# EAGLE design mini (EAGLE 7.1.0)
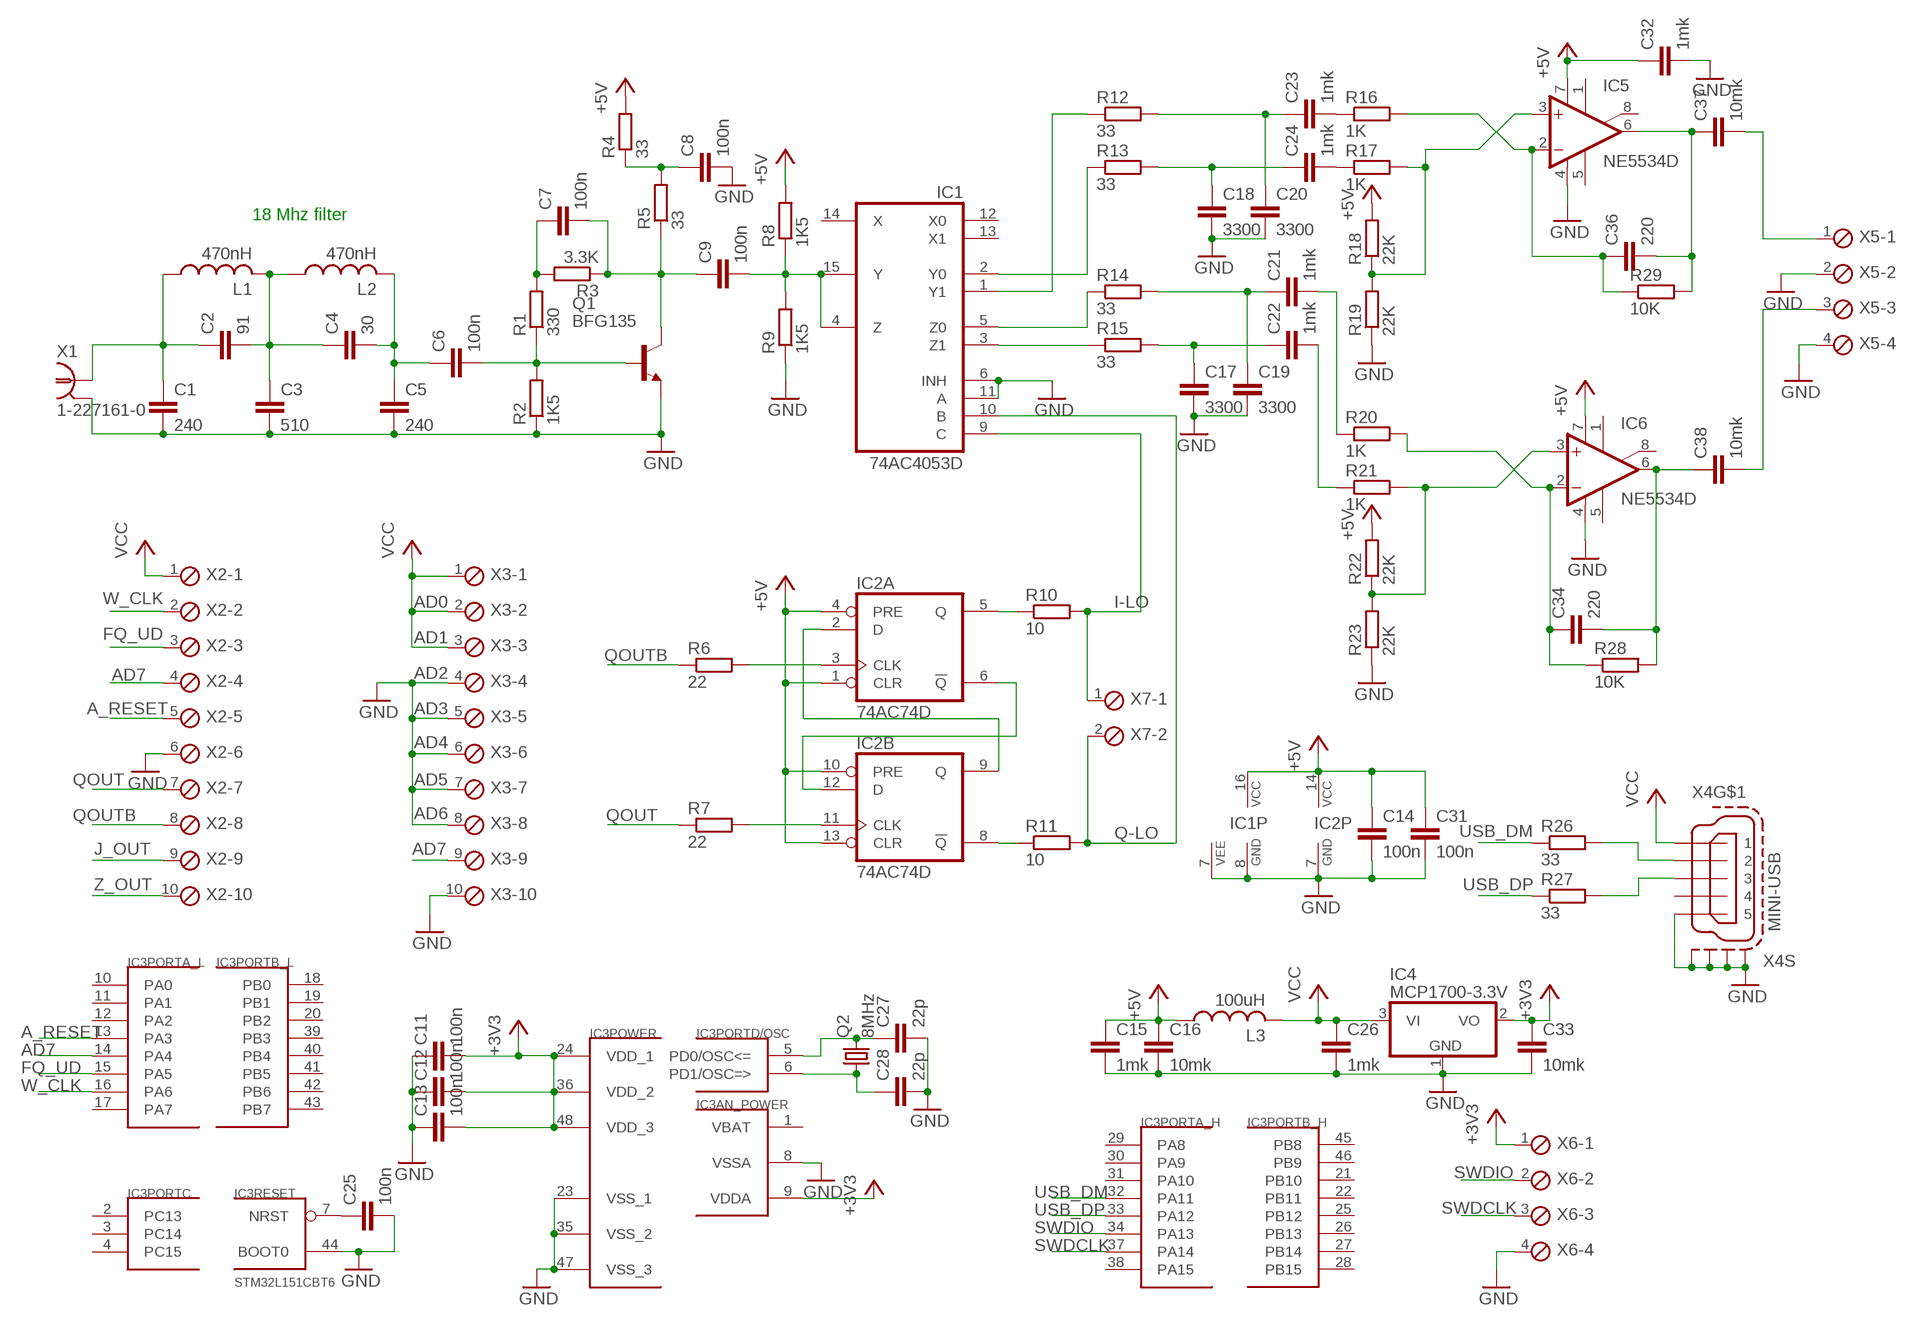
[diagram p0: schematic, sheet 1]

## Parts
C1  240  C-EUC0805  [C0805]
C2  91  C-EUC0805  [C0805]
C3  510  C-EUC0805  [C0805]
C4  30  C-EUC0805  [C0805]
C5  240  C-EUC0805  [C0805]
C6  100n  C-EUC0603  [C0603]
C7  100n  C-EUC0603  [C0603]
C8  100n  C-EUC0603  [C0603]
C9  100n  C-EUC0603  [C0603]
C11  100n  C-EUC0603  [C0603]
C12  100n  C-EUC0603  [C0603]
C13  100n  C-EUC0603  [C0603]
C14  100n  C-EUC0603  [C0603]
C15  1mk  C-EUC0603  [C0603]
C16  10mk  C-EUC0805  [C0805]
C17  3300  C-EUC0805  [C0805]
C18  3300  C-EUC0805  [C0805]
C19  3300  C-EUC0805  [C0805]
C20  3300  C-EUC0805  [C0805]
C21  1mk  C-EUC0603  [C0603]
C22  1mk  C-EUC0603  [C0603]
C23  1mk  C-EUC0603  [C0603]
C24  1mk  C-EUC0603  [C0603]
C25  100n  C-EUC0603  [C0603]
C26  1mk  C-EUC0603  [C0603]
C27  22p  C-EUC0603  [C0603]
C28  22p  C-EUC0603  [C0603]
C31  100n  C-EUC0603  [C0603]
C32  1mk  C-EUC0603  [C0603]
C33  10mk  C-EUC0805  [C0805]
C34  220  C-EUC0805  [C0805]
C36  220  C-EUC0805  [C0805]
C37  10mk  C-EUC0805  [C0805]
C38  10mk  C-EUC0805  [C0805]
IC1  74AC4053D  4053D  [SO16]
IC2  74AC74D  [SO14]
IC3  STM32L151CBT6  STM32F10XCXT6  [TQFP48]
IC4  MCP1700-3.3V  MCP1703CB  [SOT23]
IC5  NE5534D  [SO08]
IC6  NE5534D  [SO08]
L1  470nH  L-USL3225M  [L3225M]
L2  470nH  L-USL3225M  [L3225M]
L3  100uH  L-US0207/12  [0207/12]
Q1  BFG135  [SOT223]
Q2  8MHz  CRYSTALHC49S  [HC49/S]
R1  330  R-EU_R0603  [R0603]
R2  1K5  R-EU_R0603  [R0603]
R3  3.3K  R-EU_R0603  [R0603]
R4  33  R-EU_R0603  [R0603]
R5  33  R-EU_R0603  [R0603]
R6  22  R-EU_R0603  [R0603]
R7  22  R-EU_R0603  [R0603]
R8  1K5  R-EU_R0603  [R0603]
R9  1K5  R-EU_R0603  [R0603]
R10  10  R-EU_R0603  [R0603]
R11  10  R-EU_R0603  [R0603]
R12  33  R-EU_R0603  [R0603]
R13  33  R-EU_R0603  [R0603]
R14  33  R-EU_R0603  [R0603]
R15  33  R-EU_R0603  [R0603]
R16  1K  R-EU_R0603  [R0603]
R17  1K  R-EU_R0603  [R0603]
R18  22K  R-EU_R0603  [R0603]
R19  22K  R-EU_R0603  [R0603]
R20  1K  R-EU_R0603  [R0603]
R21  1K  R-EU_R0603  [R0603]
R22  22K  R-EU_R0603  [R0603]
R23  22K  R-EU_R0603  [R0603]
R26  33  R-EU_R0603  [R0603]
R27  33  R-EU_R0603  [R0603]
R28  10K  R-EU_R0603  [R0603]
R29  10K  R-EU_R0603  [R0603]
X1  1-227161-0  [AMP_227161]
X2  MPT10  [10POL254]
X3  MPT10  [10POL254]
X4  MINI-USB  MINI-USB-SCHIELD-32005-301  [32005-301]
X5  MPT4  [4POL254]
X6  MPT4  [4POL254]
X7  MPT2  [2POL254]

## Nets
+3V3: C11.2 C12.2 C13.2 C33.1 IC3.9(AN_POWER:VDDA) IC3.24(POWER:VDD_1) IC3.36(POWER:VDD_2) IC3.48(POWER:VDD_3) IC4.2(VO) X6.1
+5V: C14.1 C15.1 C16.1 C31.1 C32.1 IC1.16(VCC) IC2.1(A:CLR) IC2.4(A:PRE) IC2.10(B:PRE) IC2.13(B:CLR) IC2.14(P:VCC) IC5.7(V+) IC6.7(V+) L3.1 R4.2 R8.2 R18.2 R22.2
A_RESET: IC3.13(PORTA_L:PA3) X2.5
AD7: IC3.14(PORTA_L:PA4) X2.4
FQ_UD: IC3.15(PORTA_L:PA5) X2.3
GND: C1.2 C3.2 C5.2 C8.2 C11.1 C12.1 C13.1 C14.2 C15.2 C16.2 C17.2 C18.2 C19.2 C20.2 C25.2 C26.2 C27.2 C28.2 C31.2 C32.2 C33.2 IC1.6(INH) IC1.7(VEE) IC1.8(GND) IC1.11(A) IC2.7(P:GND) IC3.8(AN_POWER:VSSA) IC3.23(POWER:VSS_1) IC3.35(POWER:VSS_2) IC3.44(RESET:BOOT0) IC3.47(POWER:VSS_3) IC4.1(GND) IC5.4(V-) IC6.4(V-) Q1.1(E) Q1.3(E) R2.1 R9.1 R19.1 R23.1 X1.2 X2.6 X3.4 X3.5 X3.6 X3.7 X3.8 X3.10 X4.5 X4.M1(S:S1) X4.M2(S:S2) X4.M3(S:S3) X4.M4(S:S4) X5.2 X5.4 X6.4
I-LO: IC1.9(C) R10.2 X7.1
J_OUT: X2.9
N$1: IC2.2(A:D) IC2.9(B:Q)
N$2: IC2.6(A:!Q) IC2.12(B:D)
N$3: IC2.5(A:Q) R10.1
N$4: IC2.8(B:!Q) R11.1
N$5: IC1.3(Z1) R15.1
N$6: C9.2 IC1.4(Z) IC1.15(Y) R8.1 R9.2
N$7: C7.1 R1.2 R3.2
N$8: IC1.5(Z0) R14.1
N$9: IC1.2(Y0) R13.1
N$10: IC1.1(Y1) R12.1
N$11: C17.1 C22.1 R15.2
N$12: C19.1 C21.1 R14.2
N$13: C18.1 C24.1 R13.2
N$14: C20.1 C23.1 R12.2
N$15: IC5.3(+IN) R17.2 R18.1 R19.2
N$16: C34.2 C38.1 IC6.6(OUT) R28.2
N$17: C36.1 IC5.2(-IN) R16.2 R29.1
N$18: C36.2 C37.1 IC5.6(OUT) R29.2
N$19: C23.2 R16.1
N$20: C21.2 R20.1
N$21: C22.2 R21.1
N$22: C34.1 IC6.2(-IN) R20.2 R28.1
N$23: IC6.3(+IN) R21.2 R22.1 R23.2
N$25: C24.2 R17.1
N$27: C27.1 IC3.5(PORTD/OSC:PD0/OSC<=) Q2.2
N$28: R26.2 X4.2
N$29: R27.2 X4.3
N$30: C28.1 IC3.6(PORTD/OSC:PD1/OSC=>) Q2.1
N$31: IC2.3(A:CLK) R6.2
N$32: IC2.11(B:CLK) R7.2
N$33: C4.2 C5.1 C6.1 L2.2
N$34: C7.2 C9.1 Q1.4(C) R3.1 R5.1
N$35: C25.1 IC3.7(RESET:NRST)
N$36: X3.9
N$37: C8.1 R4.1 R5.2
N$38: C37.2 X5.1
N$39: C38.2 X5.3
N$40: C1.1 C2.1 L1.1 X1.1
N$41: C2.2 C3.1 C4.1 L1.2 L2.1
N$44: C6.2 Q1.2(B) R1.1 R2.2
Q-LO: IC1.10(B) R11.2 X7.2
QOUT: R7.1 X2.7
QOUTB: R6.1 X2.8
SWDCLK: IC3.37(PORTA_H:PA14) X6.3
SWDIO: IC3.34(PORTA_H:PA13) X6.2
USB_DM: IC3.32(PORTA_H:PA11) R26.1
USB_DP: IC3.33(PORTA_H:PA12) R27.1
VCC: C26.1 IC4.3(VI) L3.2 X2.1 X3.1 X3.2 X3.3 X4.1
W_CLK: IC3.16(PORTA_L:PA6) X2.2
Z_OUT: X2.10
Unconnected: IC1.12(X0) IC1.13(X1) IC1.14(X) IC3.2(PORTC:PC13) IC3.3(PORTC:PC14) IC3.4(PORTC:PC15) IC3.10(PORTA_L:PA0) IC3.11(PORTA_L:PA1) IC3.12(PORTA_L:PA2) IC3.17(PORTA_L:PA7) IC3.18(PORTB_L:PB0) IC3.19(PORTB_L:PB1) IC3.20(PORTB_L:PB2) IC3.21(PORTB_H:PB10) IC3.22(PORTB_H:PB11) IC3.25(PORTB_H:PB12) IC3.26(PORTB_H:PB13) IC3.27(PORTB_H:PB14) IC3.28(PORTB_H:PB15) IC3.29(PORTA_H:PA8) IC3.30(PORTA_H:PA9) IC3.31(PORTA_H:PA10) IC3.38(PORTA_H:PA15) IC3.39(PORTB_L:PB3) IC3.40(PORTB_L:PB4) IC3.41(PORTB_L:PB5) IC3.42(PORTB_L:PB6) IC3.43(PORTB_L:PB7) IC3.45(PORTB_H:PB8) IC3.46(PORTB_H:PB9) IC5.1(ON) IC5.5(CMP) IC5.8(ON/CMP) IC6.1(ON) IC6.5(CMP) IC6.8(ON/CMP) X4.4

## Notes on the sheet
- 18 Mhz filter
- AD0
- AD1
- AD2
- AD3
- AD4
- AD5
- AD6
- AD7

## Power pins joined to a net without a drawn wire
VBAT: IC3.1(AN_POWER:VBAT)

## Library data of the parts
C1-C9 C11-C28 C31-C34 C36-C38 = rcl:C-EU: CAPACITOR, European symbol
IC1 = 40xx:4053: Triple 2-channel ANALOG MULTIPLEXER
IC2 = 74xx-eu:74*74: Dual D type positive edge triggered FLIP FLOP, preset and clear
IC3 = stm32:STM32F10XCXT6: ST STM32F101/103 48pin LQFP
IC4 = linear:MCP1703: 250 mA, 16V, Low Quiescent Current LDO Regulator Source: http://ww1.microchip.com/downloads/en/DeviceDoc/22049b.pdf
IC5 IC6 = linear:NE5534: LOW-NOISE OPERATIONAL AMPLIFIER Source: http://focus.ti.com/lit/ds/symlink/ne5534.pdf
L1-L3 = rcl:L-US: INDUCTOR, American symbol
Q1 = balmer:BFG135: 7 GHz tranzistor
Q2 = crystal:CRYSTAL: CRYSTAL; OC_FARNELL: 1667008; OC_NEWARK: unknown
R1-R23 R26-R29 = rcl:R-EU_: RESISTOR, European symbol
X1 = con-coax:?227161*: JACK, RIGHT ANGLE, 50 OHM, PCB, BNC Source: amp_227161.pdf; MF: TYCO ELECTRONICS; MPN: 1-227161; OC_FARNELL: unknown; OC_NEWARK: 33B3200
X2 X3 = con-phoenix-254:MPT10: PHOENIX CONNECTOR; OC_FARNELL: unknown; OC_NEWARK: unknown
X4 = con-cypressindustries:MINI-USB-SCHIELD-: MINI USB-B Conector Source: www.cypressindustries.com; OC_FARNELL: unknown; OC_NEWARK: unknown
X5 X6 = con-phoenix-254:MPT4: PHOENIX CONNECTOR; OC_FARNELL: unknown; OC_NEWARK: unknown
X7 = con-phoenix-254:MPT2: PHOENIX CONNECTOR; OC_FARNELL: unknown; OC_NEWARK: unknown

## Board
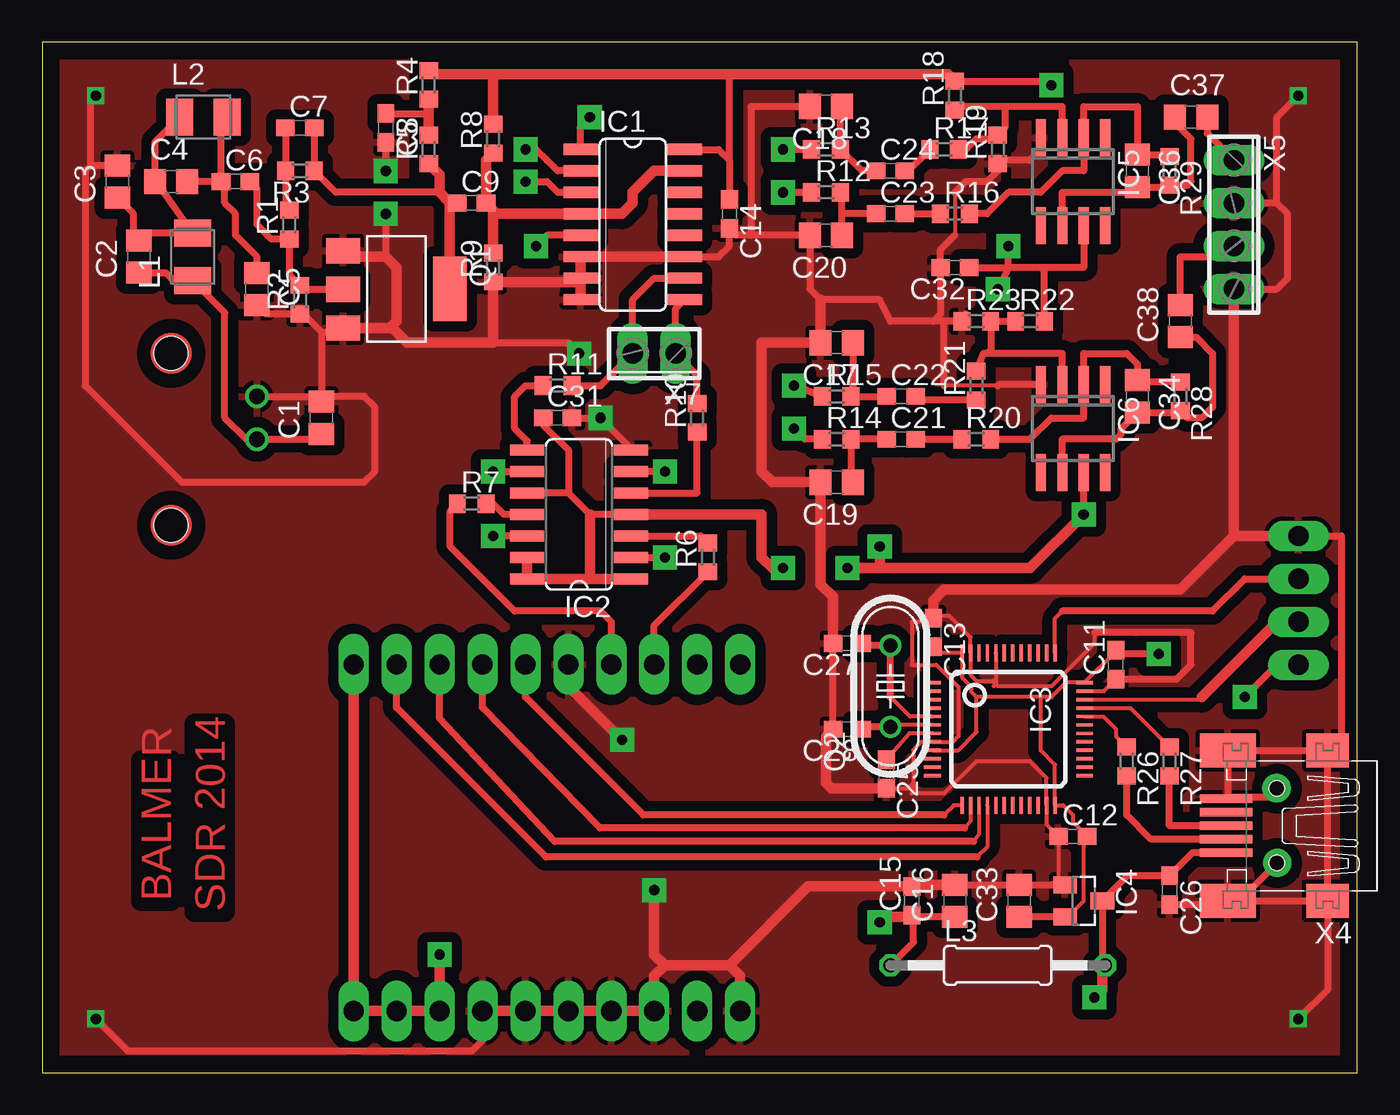
[diagram p1: board, top side]
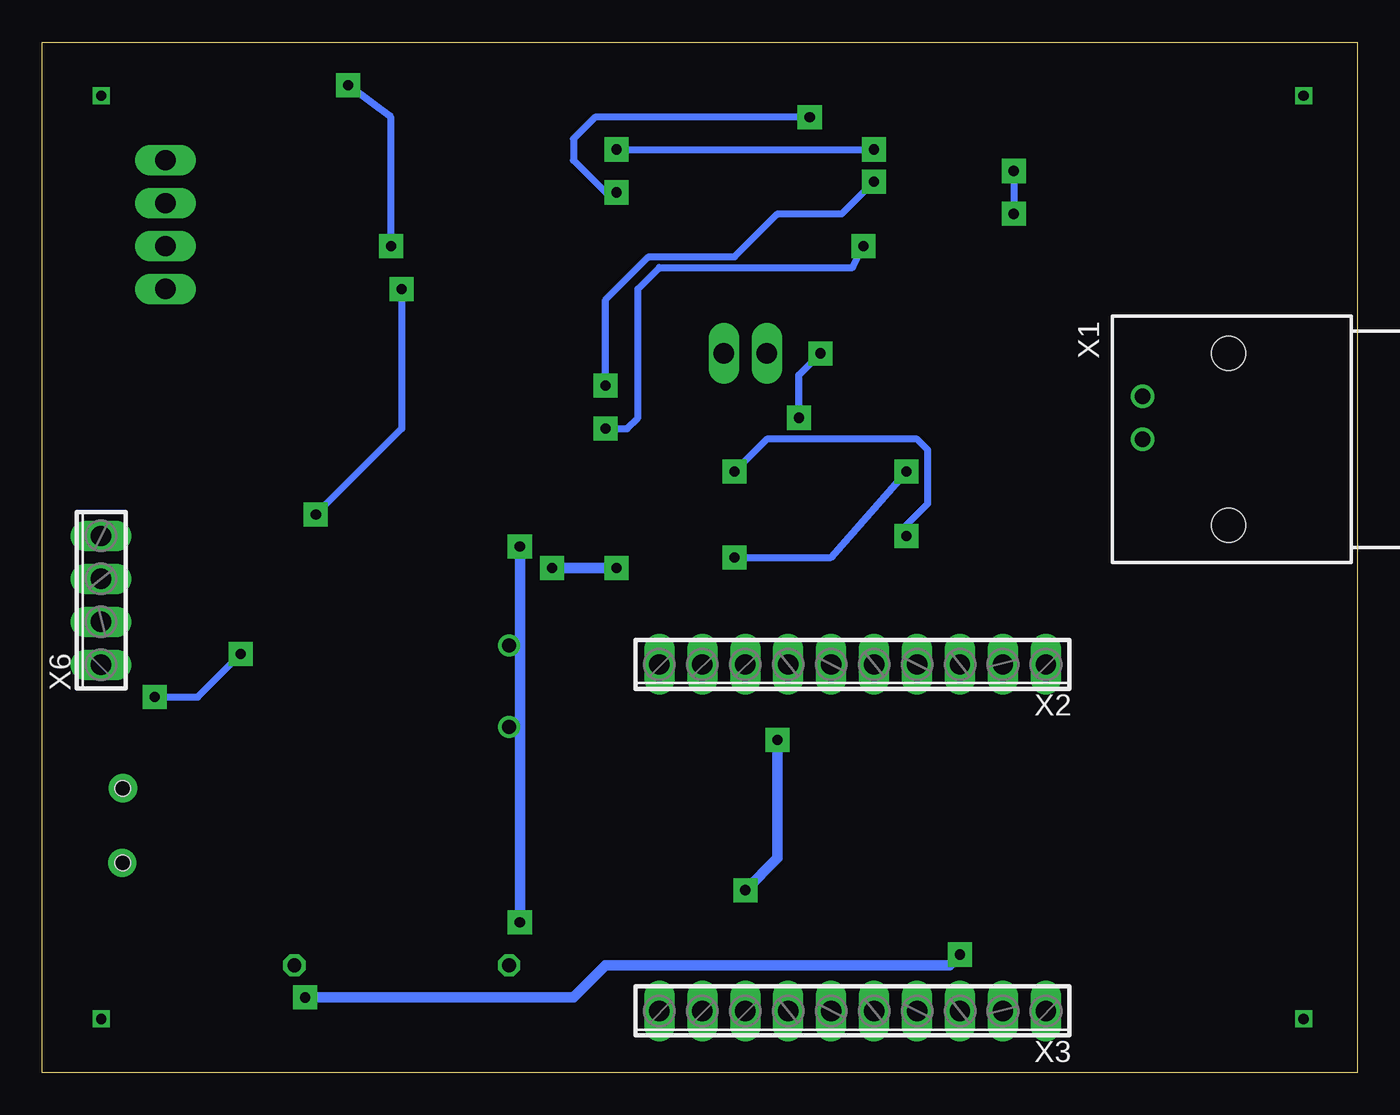
[diagram p2: board, bottom side, seen from below]

Size 77.78 x 60.95 mm. Coordinates in mm from the lower left corner, seen from the top.
Outline: 0,0 77.78,0 77.78,60.95 0,60.95 0,0
Copper layers (1*16): Top 0.035mm / dielectric 1.5mm / Bottom 0.035mm
Design rules "default": minimum track width 10mil, minimum drill 24mil, track to track 8mil, track to pad 8mil, pad to pad 8mil, via to via 8mil, smd to smd 8mil, copper to edge 40mil, drill to drill 8mil, minimum pad ring 10mil, minimum via ring 8mil, stop-mask expansion 4mil, vias tented up to drill 0mil, thermal gap 10mil

### Footprints (pad centres in the part's own frame; a part is rotated, then mirrored left to right if it is on the bottom)
C0805 = smd 1.3 x 1.5: 1 -0.95,0; 2 0.95,0
C0603 = smd 1.1 x 1: 1 -0.85,0; 2 0.85,0
SO16 = smd 0.66 x 2.032: 1 -4.445,-3.073; 2 -3.175,-3.073; 3 -1.905,-3.073; 4 -0.635,-3.073; 5 0.635,-3.073; 6 1.905,-3.073; 7 3.175,-3.073; 8 4.445,-3.073; 9 4.445,3.073; 10 3.175,3.073; 11 1.905,3.073; 12 0.635,3.073; 13 -0.635,3.073; 14 -1.905,3.073; 15 -3.175,3.073; 16 -4.445,3.073
SO14 = smd 0.66 x 2.032: 1 -3.81,-3.073; 2 -2.54,-3.073; 3 -1.27,-3.073; 4 0,-3.073; 5 1.27,-3.073; 6 2.54,-3.073; 7 3.81,-3.073; 8 3.81,3.073; 9 2.54,3.073; 10 1.27,3.073; 11 0,3.073; 12 -1.27,3.073; 13 -2.54,3.073; 14 -3.81,3.073
TQFP48 = smd 0.2 x 1: 1 -2.75,-4.5; 2 -2.25,-4.5; 3 -1.75,-4.5; 4 -1.25,-4.5; 5 -0.75,-4.5; 6 -0.25,-4.5; 7 0.25,-4.5; 8 0.75,-4.5; 9 1.25,-4.5; 10 1.75,-4.5; 11 2.25,-4.5; 12 2.75,-4.5; 25 2.75,4.5; 26 2.25,4.5; 27 1.75,4.5; 28 1.25,4.5; 29 0.75,4.5; 30 0.25,4.5; 31 -0.25,4.5; 32 -0.75,4.5; 33 -1.25,4.5; 34 -1.75,4.5; 35 -2.25,4.5; 36 -2.75,4.5 | smd 1 x 0.2: 13 4.5,-2.75; 14 4.5,-2.25; 15 4.5,-1.75; 16 4.5,-1.25; 17 4.5,-0.75; 18 4.5,-0.25; 19 4.5,0.25; 20 4.5,0.75; 21 4.5,1.25; 22 4.5,1.75; 23 4.5,2.25; 24 4.5,2.75; 37 -4.5,2.75; 38 -4.5,2.25; 39 -4.5,1.75; 40 -4.5,1.25; 41 -4.5,0.75; 42 -4.5,0.25; 43 -4.5,-0.25; 44 -4.5,-0.75; 45 -4.5,-1.25; 46 -4.5,-1.75; 47 -4.5,-2.25; 48 -4.5,-2.75
SOT23 = smd 1 x 1.4: 1 -0.95,-1.1; 2 0.95,-1.1; 3 0,1.1
SO08 = smd 0.6 x 2.2: 1 -1.905,-2.6; 2 -0.635,-2.6; 3 0.635,-2.6; 4 1.905,-2.6; 5 1.905,2.6; 6 0.635,2.6; 7 -0.635,2.6; 8 -1.905,2.6
L3225M = smd 1.6 x 2.2: 1 -1.4,0; 2 1.4,0
0207/12 = drill 0.813 octagon: 1 -6.35,0; 2 6.35,0
SOT223 = smd 1.499 x 2.007: 1 -2.261,-3.15; 2 0.025,-3.15; 3 2.311,-3.15 | smd 3.81 x 2.007: 4 0,3.15
HC49/S = drill 0.813: 1 -2.413,0; 2 2.413,0
R0603 = smd 1 x 1.1: 1 -0.85,0; 2 0.85,0
AMP_227161 = drill 0.9 pad 1.27: 1 0,-5.08; 2 -2.54,-5.08 | hole 2: -5.08,0; 5.08,0
10POL254 = drill 1.2 long: 1 -11.43,0; 2 -8.89,0; 3 -6.35,0; 4 -3.81,0; 5 -1.27,0; 6 1.27,0; 7 3.81,0; 8 6.35,0; 9 8.89,0; 10 11.43,0
32005-301 = smd 3.1 x 0.5: 1 3,1.6; 2 3,0.8; 3 3,0; 4 3,-0.8; 5 3,-1.6 | smd 2.5 x 2: M1 -3,-4.45; M2 -3,4.45 | smd 3.3 x 2: M3 2.9,4.45; M4 2.9,-4.45 | hole 0.9: 0,2.2; 0,-2.2
4POL254 = drill 1.2 long: 1 -3.81,0; 2 -1.27,0; 3 1.27,0; 4 3.81,0
2POL254 = drill 1.2 long: 1 -1.27,0; 2 1.27,0

### Placement (x,y rotation side)
C1  16.51,38.73 90 top
C2  5.71,48.26 90 top
C3  4.45,52.7 90 top
C4  7.62,52.7 0 top
C5  12.7,46.35 270 top
C6  11.43,52.7 0 top
C7  15.24,55.88 0 top
C8  20.32,55.88 270 top
C9  25.4,51.44 0 top
C11  63.5,24.13 90 top
C12  60.96,13.97 0 top
C13  52.7,26.04 270 top
C14  40.64,50.8 270 top
C15  51.44,10.16 90 top
C16  53.98,10.16 90 top
C17  46.99,43.18 180 top
C18  46.35,57.15 180 top
C19  46.99,34.92 180 top
C20  46.35,49.53 180 top
C21  50.8,37.47 0 top
C22  50.8,40.01 0 top
C23  50.16,50.8 0 top
C24  50.16,53.34 0 top
C25  49.92,17.67 270 top
C26  66.67,10.79 270 top
C27  47.62,25.4 180 top
C28  47.62,20.32 180 top
C31  30.48,38.73 0 top
C32  53.98,47.62 180 top
C33  57.78,10.16 90 top
C34  64.77,40.01 270 top
C36  64.77,53.34 270 top
C37  67.94,56.52 0 top
C38  67.31,44.45 90 top
IC1  34.92,50.16 270 top
IC2  31.75,33.02 90 top
IC3  57.15,20.32 270 top
IC4  61.59,10.16 270 top
IC5  60.96,52.7 180 top
IC6  60.96,38.1 180 top
L1  8.89,48.26 90 top
L2  9.53,56.52 0 top
L3  56.52,6.35 0 top
Q1  20.95,46.35 270 top
Q2  50.16,22.86 90 top
R1  14.61,50.16 90 top
R2  15.24,45.72 90 top
R3  15.24,53.34 180 top
R4  22.86,58.42 90 top
R5  22.86,54.61 90 top
R6  39.37,30.48 90 top
R7  25.4,33.66 0 top
R8  26.67,55.24 90 top
R9  26.67,47.62 90 top
R10  38.73,38.73 90 top
R11  30.48,40.64 0 top
R12  46.35,52.07 0 top
R13  46.35,54.61 0 top
R14  46.99,37.47 0 top
R15  46.99,40.01 0 top
R16  53.98,50.8 0 top
R17  53.34,54.61 0 top
R18  53.98,57.78 90 top
R19  56.52,54.61 90 top
R20  55.24,37.47 0 top
R21  55.24,40.64 90 top
R22  58.42,44.45 0 top
R23  55.24,44.45 0 top
R26  64.14,18.41 270 top
R27  66.67,18.41 270 top
R28  67.31,40.01 270 top
R29  66.67,53.34 270 top
X1  7.62,37.47 270 bottom
X2  29.84,24.15 180 bottom
X3  29.84,3.65 180 bottom
X4  73.03,14.61 180 top
X5  70.48,50.16 270 top
X6  74.3,27.94 90 bottom
X7  36.2,42.55 180 top

### Tracks (layer width: path | path; a pad name or v marks a point on that pad's centre or on a via)
+3V3  (via drill 0.6 pad 1.42)
  Top 0.25: C11.2 63.5,24.92 IC3.36 60.53,23.07 59.69,22.23 59.05,22.23 | C13.2 53.07,24.82 IC3.48 54.4,23.39 54.93,22.86 54.93,22.54 55.24,22.23 | 59.05,22.23 55.24,22.23 | IC3.9 54.17,19.07 55.26,20.16 55.26,22.21 55.24,22.23 | 59.05,22.23 59.05,19.05 59.9,18.2 IC3.24 60.38,15.82 60.96,15.24 60.96,14.82 C12.2 61.59,13.76 61.59,10.16 60.65,9.21 IC4.2
  Top 0.406: IC4.2 C33.1 57.69,9.31 | X6.1 73.03,24.13 v71.12,22.23 | v66.04,24.77 63.72,24.77 C11.2
  Bottom 0.406: v71.12,22.23 68.58,22.23 v66.04,24.77
+5V  (via drill 0.6 pad 1.42)
  Top 0.406: C16.1 51.53,9.21 | L3.1 51.53,7.72 51.53,9.21 | C31.1 29.63,38.31 31.11,36.83 31.11,34.29 | 31.11,34.29 IC2.10 | 31.11,34.29 32.38,33.02 IC2.4 | IC5.7 61.59,47.62 59.05,47.62 | 59.05,47.62 57.15,47.62 | v61.59,33.02 IC6.7 | R22.2 59.27,47.41 59.05,47.62 | IC1.16 40.01,54.61 40.64,53.98 | 40.64,53.98 C14.1 | 51.53,9.21 C15.1 | 57.15,47.62 v57.15,48.9 | 57.15,47.62 v56.52,46.35 | C32.1 57.15,47.62 | R18.2 59.48,58.63 v59.69,58.42 | 40.64,53.98 40.64,59.05
  Top 0.61: R8.2 26.67,59.05 | 26.67,59.05 23.07,59.05 R4.2 | IC2.1 32.38,29.21 | 32.38,29.21 32.38,33.02 | 32.38,29.21 IC2.14 IC2.13 | IC2.4 42.55,33.02 42.55,30.48 43.18,29.84 v43.81,29.84 | 49.53,29.84 58.42,29.84 v61.59,33.02 | 51.53,9.21 49.85,9.21 v49.53,8.89 | v49.53,31.11 49.53,29.84 | 49.53,29.84 v47.62,29.84 | 26.67,59.05 40.64,59.05 53.55,59.05 R18.2
  Bottom 0.406: v56.52,46.35 56.52,38.1 v61.59,33.02 | v57.15,48.9 57.15,56.52 v59.69,58.42
  Bottom 0.61: v49.53,8.89 v49.53,31.11 | v47.62,29.84 v43.81,29.84
A_RESET
  Top 0.25: IC3.13 53.92,15.82 53.34,15.24
  Top 0.406: 53.34,15.24 35.56,15.24 28.57,22.23 X2.5
AD7
  Top 0.25: IC3.14 54.9,14.89 54.57,14.48
  Top 0.406: 54.57,14.48 32.98,14.48 26.04,21.59 X2.4
FQ_UD
  Top 0.25: IC3.15 55.4,14.12 55.07,13.67
  Top 0.406: 55.07,13.67 30.31,13.67 23.5,20.95 X2.3
GND  (via drill 0.6, 0.6 pad 1.42, 0.6 pad 1.68)
  Top 0.25: IC3.35 62.79,22.57 C11.1 | 62.23,26.04 62.23,25.4 59.69,22.86 56.52,22.86 56.4,22.98 | IC3.44 56.4,22.98 | 56.28,22.86 56.4,22.98 | 56.4,22.98 56.2,23.18 55.24,23.18 54.9,23.52 IC3.47 54.9,25.76 53.65,27.01 52.83,27.01 C13.1 52.92,26.67 51.44,26.67 51.44,24.13 52.88,24.13 54.2,22.81 54.2,19.91 53.86,19.57 IC3.8 52.01,19.57 51.52,19.09 51.52,17.14 | 51.52,17.14 51.52,16.6 51.44,16.51 53.34,16.51 55.24,18.41 58.42,18.41 59.4,17.43 IC3.23 59.4,14.68 C12.1 60.11,11.53 59.69,11.11 | C25.2 51.2,16.82 51.52,17.14 | 56.52,40.64 53.34,40.64 | 53.98,52.07 53.98,49.53
  Top 0.406: 70.12,16.3 X4.M4 X4.M1 | 70.12,16.3 X4.5 | X4.M2 X4.M1 | X4.M3 X4.M2 | C26.2 69.92,9.95 X4.M3 | C33.2 59.69,11.11 IC4.1 | 57.69,11.01 C33.2 | C16.2 C33.2 | X4.M3 70.48,9.79 70.48,9.85 v73.05,12.41 | C11.1 67.09,23.28 67.94,24.13 67.94,26.04 62.23,26.04 | X6.4 76.83,31.75 76.83,19.86 X4.M1 | IC2.7 34.82,36.93 v33.02,38.73 C31.2 | 54.61,44.87 R23.1 53.34,44.45 | 53.34,44.45 52.7,44.45 | 52.7,44.45 50.16,44.45 49.53,45.72 46.04,45.72 45.41,46.35 C20.2 41.91,49.53 | C8.2 v20.32,53.34 | v20.32,50.8 20.32,48.26 | IC1.11 40.01,48.26 40.64,48.9 C14.2 41.06,49.53 41.91,49.53 | C28.2 C27.2 | 26.67,43.18 31.11,43.18 v31.75,42.55 | C18.2 41.91,57.15 41.91,49.53 | IC6.4 56.58,40.7 56.52,40.64 | 53.34,40.64 53.34,44.45 | X5.4 73.03,46.35 73.66,46.99 73.66,50.8 73.03,51.44 | 73.03,51.44 X5.2 | 52.7,44.45 53.12,44.87 C32.2 53.12,48.68 53.98,49.53 | 53.98,52.07 54.61,52.7 55.88,52.7 56.52,53.34 R19.1 56.73,53.98 58.42,53.98 59.05,54.61 IC5.4 | 16.51,43.81 15.46,44.87 R2.1 13.23,44.87 C5.2 | 16.51,43.81 17.58,43.81 Q1.3 | X1.2 16.19,40.01 C1.2 | 16.51,43.81 C1.2 | C3.2 2.85,53.66 | 2.85,53.66 2.54,53.34 2.54,40.64 8.26,34.92 19.05,34.92 19.68,35.56 19.68,39.37 19.05,40.01 16.83,40.01 C1.2 | 73.03,51.44 73.03,56.52 v74.3,57.78 | 70.12,16.3 72.5,16.3 v73.01,16.82 | X4.M2 76.03,4.91 v74.3,3.17 | 2.85,53.66 2.85,57.47 v3.17,57.78 | X3.4 26.04,1.91 25.4,1.27 5.08,1.27 v3.17,3.17
  Top 0.61: Q1.3 20.55,44.04 20.64,44.13 | 20.64,44.13 20.95,44.45 20.95,47.62 20.32,48.26 18.16,48.26 Q1.1 | 20.64,44.13 21.59,43.18 26.67,43.18 R9.1 31.64,46.77 IC1.7 | IC1.7 IC1.6 IC1.11 | IC1.8 IC1.7 | X3.4 X3.5 X3.6 X3.7 X3.8 36.2,5.71 36.83,6.35 | 36.83,6.35 40.64,6.35 | 40.64,6.35 41.27,5.71 X3.10 | C16.2 51.53,11.11 C15.2 45.3,11.01 40.64,6.35 | C25.2 46.68,16.82 46.35,17.14 46.35,19.9 C28.2 | C27.2 46.77,28.16 46.04,28.89 C19.2 43.18,34.92 42.55,35.56 42.55,43.18 C17.2 46.04,45.72 | 70.48,31.75 67.31,28.57 53.34,28.57 52.7,27.94 C13.1 | 70.48,31.75 X6.4 | X2.6 31.11,22.86 v34.29,19.68 | v36.2,10.79 36.2,6.99 36.83,6.35 | X5.4 70.48,31.75
  Bottom 0.406: v20.32,53.34 v20.32,50.8 | v33.02,38.73 33.02,41.27 v31.75,42.55
  Bottom 0.61: v34.29,19.68 34.29,12.7 v36.2,10.79
  pour Top (isolate 0.61): 0,60.96 78.11,60.96 78.11,0 0,0
I-LO
  Top 0.406: R10.2 38.73,41.27 X7.1 37.47,45.19 IC1.9
N$1  (via drill 0.6 pad 1.42)
  Top 0.406: IC2.2 v36.83,30.48 | v26.67,35.56 IC2.9
  Bottom 0.406: v36.83,30.48 31.11,30.48 v26.67,35.56
N$2  (via drill 0.6 pad 1.42)
  Top 0.406: IC2.12 v26.67,31.75 | v36.83,35.56 IC2.6
  Bottom 0.406: v26.67,31.75 26.67,32.38 25.4,33.66 25.4,36.83 26.04,37.47 34.92,37.47 v36.83,35.56
N$3
  Top 0.406: IC2.5 38.73,34.29 R10.1
N$4
  Top 0.406: IC2.8 28.68,37.36 27.94,38.1 27.94,40.01 28.57,40.64 R11.1
N$5  (via drill 0.6 pad 1.42)
  Top 0.406: R15.1 v44.45,40.64 | v28.57,52.7 29.84,52.7 30.48,52.07 IC1.3
  Bottom 0.406: v44.45,40.64 44.45,45.72 41.91,48.26 36.83,48.26 34.29,50.8 30.48,50.8 v28.57,52.7
N$6
  Top 0.61: 26.67,50.8 IC1.4 34.29,50.8 34.92,51.44 34.92,52.07 36.2,53.34 IC1.15 | R8.1 26.25,53.98 C9.2 26.67,51.02 26.67,50.8 | R9.2 26.67,50.8
N$7
  Top 0.406: C7.1 R3.2 14.39,51.23 R1.2
N$8  (via drill 0.6 pad 1.42)
  Top 0.406: R14.1 45.09,37.47 v44.45,38.1 | IC1.5 29.84,49.53 v29.21,48.9
  Bottom 0.406: v44.45,38.1 43.18,38.1 42.55,38.73 42.55,46.35 41.27,47.62 29.84,47.62 v29.21,48.9
N$9  (via drill 0.6 pad 1.42)
  Top 0.406: R13.1 v43.81,54.61 | v28.57,54.61 29.21,54.61 29.84,53.98 30.48,53.34 IC1.2
  Bottom 0.406: v43.81,54.61 v28.57,54.61
N$10  (via drill 0.6 pad 1.42)
  Top 0.406: IC1.1 31.85,55.98 v32.38,56.52 | v43.81,52.07 R12.1
  Bottom 0.406: v32.38,56.52 45.09,56.52 46.35,55.24 46.35,53.98 44.45,52.07 v43.81,52.07
N$11
  Top 0.406: C22.1 R15.2 47.94,40.74 C17.1
N$12
  Top 0.406: C19.1 47.84,35.02 R14.2 C21.1
N$13
  Top 0.406: C18.1 47.2,57.69 R13.2 48.48,53.34 C24.1
N$14
  Top 0.406: C20.1 47.3,50.8 | 47.3,50.8 47.3,51.97 R12.2 | C23.1 47.3,50.8
N$15
  Top 0.406: IC5.3 60.33,57.15 56.94,57.15 | R17.2 54.61,54.61 55.24,55.24 56.3,55.24 R19.2 56.94,55.88 56.94,57.15 | 56.94,57.15 54.19,57.15 R18.1
N$16
  Top 0.406: IC6.6 60.33,37.47 63.5,37.47 63.81,37.78 63.81,38.1 C34.2 67.21,39.05 R28.2 67.73,38.73 68.58,38.73 69.22,39.37 69.22,42.55 68.26,43.5 C38.1
N$17
  Top 0.406: R29.1 66.58,54.29 C36.1 64.77,57.15 61.59,57.15 IC5.2 61.59,53.34 60.33,53.34 59.05,52.07 57.15,52.07 55.88,50.8 R16.2
N$18
  Top 0.406: IC5.6 60.33,52.07 64.45,52.07 C36.2 66.58,52.39 R29.2 67.73,52.49 67.94,52.7 67.94,55.24 67.31,55.88 67.31,56.2 C37.1 66.67,56.2
N$19
  Top 0.406: C23.2 R16.1
N$20
  Top 0.406: C21.2 R20.1
N$21
  Top 0.406: R21.1 51.87,39.79 C22.2
N$22
  Top 0.406: R20.2 58.42,37.47 59.69,38.73 61.59,38.73 IC6.2 61.59,42.55 64.14,42.55 64.77,41.91 C34.1 64.87,40.85 R28.1
N$23
  Top 0.406: R22.1 R23.2 56.09,42.76 55.88,42.55 | IC6.3 60.33,42.55 55.88,42.55 | 55.88,42.55 55.66,42.55 R21.2
N$25
  Top 0.406: C24.2 51.22,53.34 R17.1
N$27
  Top 0.25: IC3.5 51.32,21.07 50.16,22.23
  Top 0.406: 50.16,22.23 Q2.2 48.6,25.27 C27.1
N$28
  Top 0.406: X4.2 65.57,13.8 64.14,15.24 R26.2
N$29
  Top 0.406: X4.3 66.67,14.61 R27.2
N$30
  Top 0.25: IC3.6 50.29,20.57 Q2.1
  Top 0.406: Q2.1 48.6,20.45 C28.1
N$31
  Top 0.406: IC2.3 38.95,31.75 R6.2
N$32
  Top 0.406: IC2.11 27.3,33.02 26.67,33.66 R7.2
N$33
  Top 0.406: C5.1 12.7,48.26 11.43,49.53 11.43,50.8 10.79,51.44 10.79,52.49 C6.1 | C6.1 C4.2 | C6.1 10.58,56.17 L2.2
N$34
  Top 0.406: 23.5,52.07 17.36,52.07 R3.1 C7.2
  Top 0.61: Q1.4 24.11,51.46 | 24.11,51.46 23.5,52.07 23.5,53.12 R5.1 | C9.1 24.13,51.44 24.11,51.46
N$35
  Top 0.25: IC3.7 51.28,20.07 C25.1
N$37
  Top 0.406: C8.1 22.64,56.73 22.86,56.52
  Top 0.61: R5.2 22.86,56.52 R4.1
N$38
  Top 0.406: C37.2 68.89,55.56 X5.1
N$39
  Top 0.406: C38.2 67.31,48.26 69.85,48.26 X5.3
N$40
  Top 0.406: C2.1 7.3,47.31 7.62,46.99 8.76,46.99 L1.1 10.79,44.95 10.79,38.73 12.06,37.47 X1.1 16.19,37.47 C1.1
N$41
  Top 0.406: L2.1 6.67,55.06 C4.1 6.99,52.39 L1.2 6.17,49.66 C2.2 5.4,48.9 5.4,50.8 C3.1
N$44
  Top 0.406: Q1.2 15.48,46.33 R2.2 14.61,47.2 R1.1 13.55,49.31 12.7,50.16 12.7,52.28 C6.2
Q-LO
  Top 0.406: R11.2 33.02,40.64 X7.2 34.92,45.72 36.2,46.99 IC1.10
QOUT
  Top 0.406: X2.7 33.66,26.67 33.02,27.3 27.94,27.3 24.13,31.11 24.13,33.23 R7.1
QOUTB
  Top 0.406: X2.8 36.2,26.45 R6.1
SWDCLK
  Top 0.25: IC3.37 59.9,26.88 60.33,27.3
  Top 0.406: 60.33,27.3 69.22,27.3 71.12,29.21 X6.3
SWDIO
  Top 0.25: IC3.34 68.42,22.07 68.58,22.23
  Top 0.61: X6.2 73.03,26.67 68.58,22.23
USB_DM
  Top 0.25: IC3.32 62.75,21.07 63.5,20.32 63.5,19.9 R26.1
USB_DP
  Top 0.25: IC3.33 64.37,21.57 R27.1
VCC  (via drill 0.6 pad 1.42)
  Top 0.406: X4.1 68.03,13.01 C26.1 64.18,11.64 IC4.3 62.7,6.52
  Top 0.61: L3.2 62.7,6.52 62.7,4.91 v62.23,4.45 | X2.1 X3.1 X3.2 X3.3 v23.5,6.99
  Bottom 0.61: v62.23,4.45 46.35,4.45 44.45,6.35 24.13,6.35 v23.5,6.99
W_CLK
  Top 0.25: IC3.16 55.9,13.36 55.29,12.75
  Top 0.406: 55.29,12.75 29.79,12.75 20.95,21.59 X2.2
(copper drawn outside any net)
  shapes: Top circle x2

### Text on the board
Top: BALMER | SDR 2014